# EAGLE design Own_26650_Board_v1.1_Final_AR (EAGLE 9.6.2)
COMPANY: ADAFRUIT INDUSTRIES; DRAWN: KTOWN; REV: A; YEAR: 2019
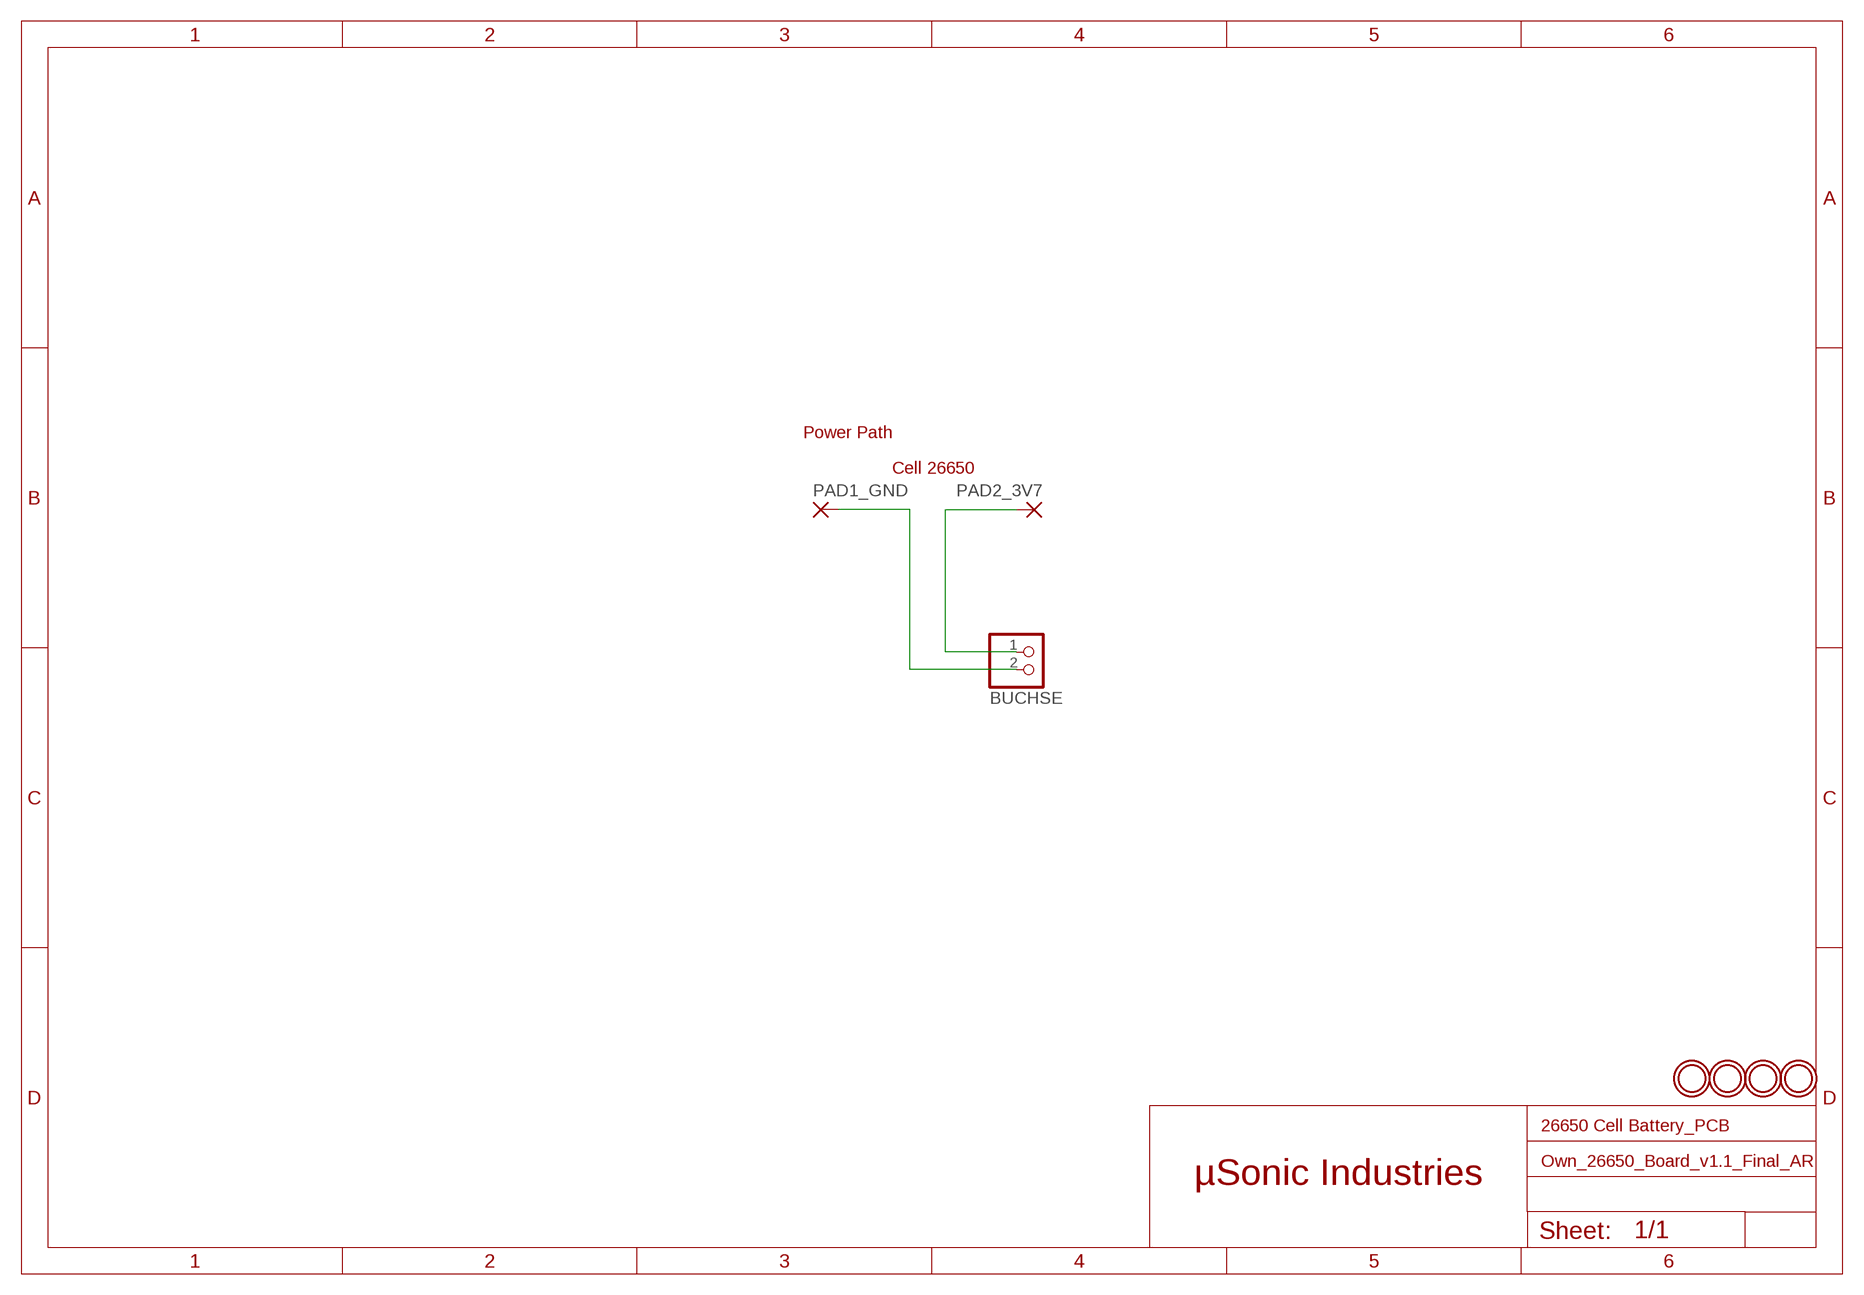
[diagram p0: schematic, sheet 1]

## Parts
BUCHSE  JST_2PINOWN  [JST-PH-2-THMOWN]
PAD1_GND  WIREPADSMDOWN  [OWN]
PAD2_3V7  WIREPADSMDOWN  [OWN]
U$1  MOUNTINGHOLE2.5  [MOUNTINGHOLE_2.5_PLATED]
U$2  MOUNTINGHOLE2.5  [MOUNTINGHOLE_2.5_PLATED]
U$3  MOUNTINGHOLE2.5  [MOUNTINGHOLE_2.5_PLATED]
U$5  MOUNTINGHOLE2.5  [MOUNTINGHOLE_2.5_PLATED]

## Nets
3V7: BUCHSE.1 PAD2_3V7.1(P)
GND: BUCHSE.2 PAD1_GND.1(P)

## Notes on the sheet
- Power Path
- Cell 26650
- 26650 Cell Battery_PCB
- µSonic Industries

## Library data of the parts
BUCHSE = adafruit2:JST_2PIN: JST 2-Pin Connectors of various flavors SMT-RA (S2B-PH-SM4) 4UConnector #17311 SMT (B2B-PH-SM4) THM-RA (S2B-PH) THM (B2B-PH)
PAD1_GND PAD2_3V7 = wirepad2:WIREPAD: Wire PAD connect wire on PCB
U$1-U$3 U$5 = microbuilder:MOUNTINGHOLE: Mounting Hole For #2 screws (0.086"/2.18mm width, 0.094"/2.4mm hole) use 2.5mm; BOM: EXCLUDE

## Net classes
0 default: width 0.25 mm

## Board
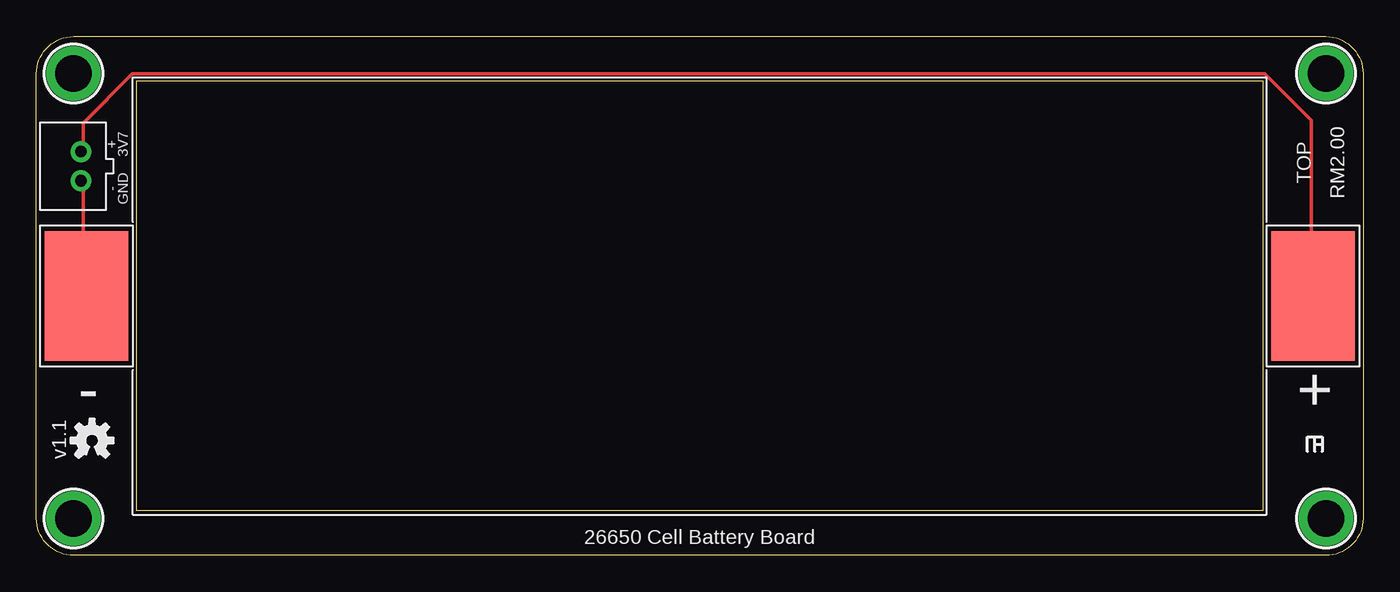
[diagram p1: board, top side]
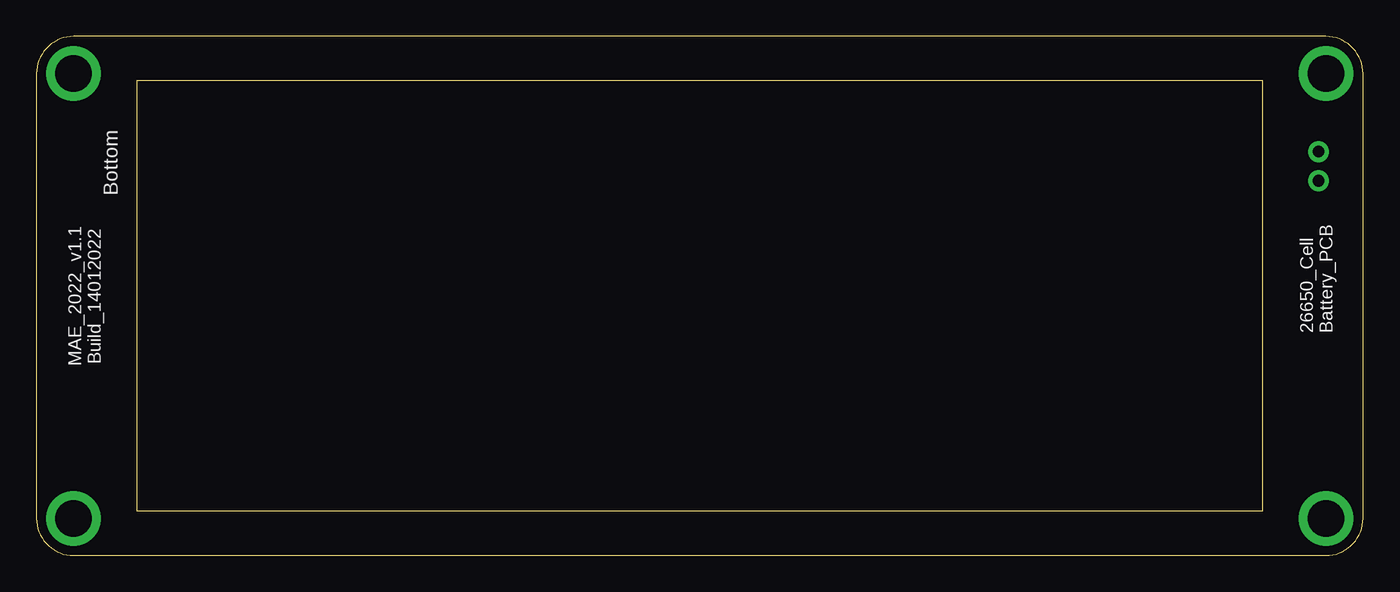
[diagram p2: board, bottom side, seen from below]

Size 90.93 x 35.56 mm. Coordinates in mm from the lower left corner, seen from the top.
Outline: 90.93,33.02 90.93,2.54 arc-90 88.39,0 2.54,0 arc-90 0,2.54 0,33.02 arc-90 2.54,35.56 88.39,35.56 arc-90 90.93,33.02
Outline: 6.86,32.51 84.07,32.51 84.07,3.05 6.86,3.05 6.86,32.51
Copper layers (1*16): Top 0.035mm / dielectric 1.5mm / Bottom 0.035mm
Design rules "aisler_2_layer_complex": minimum track width 0.125mm, minimum drill 0.2mm, track to track 0.125mm, track to pad 0.125mm, pad to pad 0.125mm, via to via 0.125mm, smd to smd 0.125mm, copper to edge 0.3mm, drill to drill 0.25mm, minimum pad ring 0.2mm, minimum via ring 0.2mm, stop-mask expansion 0mil, vias tented up to drill 0mil, thermal gap 10mil

### Footprints (pad centres in the part's own frame; a part is rotated, then mirrored left to right if it is on the bottom)
JST-PH-2-THMOWN = drill 0.8 pad 1.422: 1 1,0; 2 -1,0
OWN = smd 5.715 x 8.89: 1 -0.127,0
MOUNTINGHOLE_2.5_PLATED = drill 2.5 pad 3.2: P$1 0,0

### Placement (x,y rotation side)
BUCHSE  3.05,26.67 90 top
PAD1_GND  3.56,17.78 0 top
PAD2_3V7  87.63,17.78 0 top
U$1  88.39,33.02 180 top
U$2  2.54,33.02 180 top
U$3  88.39,2.54 0 top
U$4  [OSHW-LOGO-S]  3.81,7.87 0 top
U$5  2.54,2.54 0 top

### Tracks (layer width: path | path; a pad name or v marks a point on that pad's centre or on a via)
3V7
  Top 0.25: BUCHSE.1 3.19,27.75 3.19,29.62 6.56,33 84.19,33 87.38,29.81 87.38,17.81 PAD2_3V7.1
GND
  Top 0.25: BUCHSE.2 3.19,25.5 3.19,18 3.38,17.81 PAD1_GND.1

### Text on the board
tPlace: + / 3V7 | TOP | RM2.00 | - / GND | - | + | v1.1 | 26650 Cell Battery Board
bPlace: Bottom | MAE_2022_v1.1 / Build_14012022 | 26650_Cell / Battery_PCB